# Altium schematic sheet PicoPrint-Connectors.SchDoc
size A3; DocumentNumber: 1; SheetNumber: 1; SheetTotal: 5
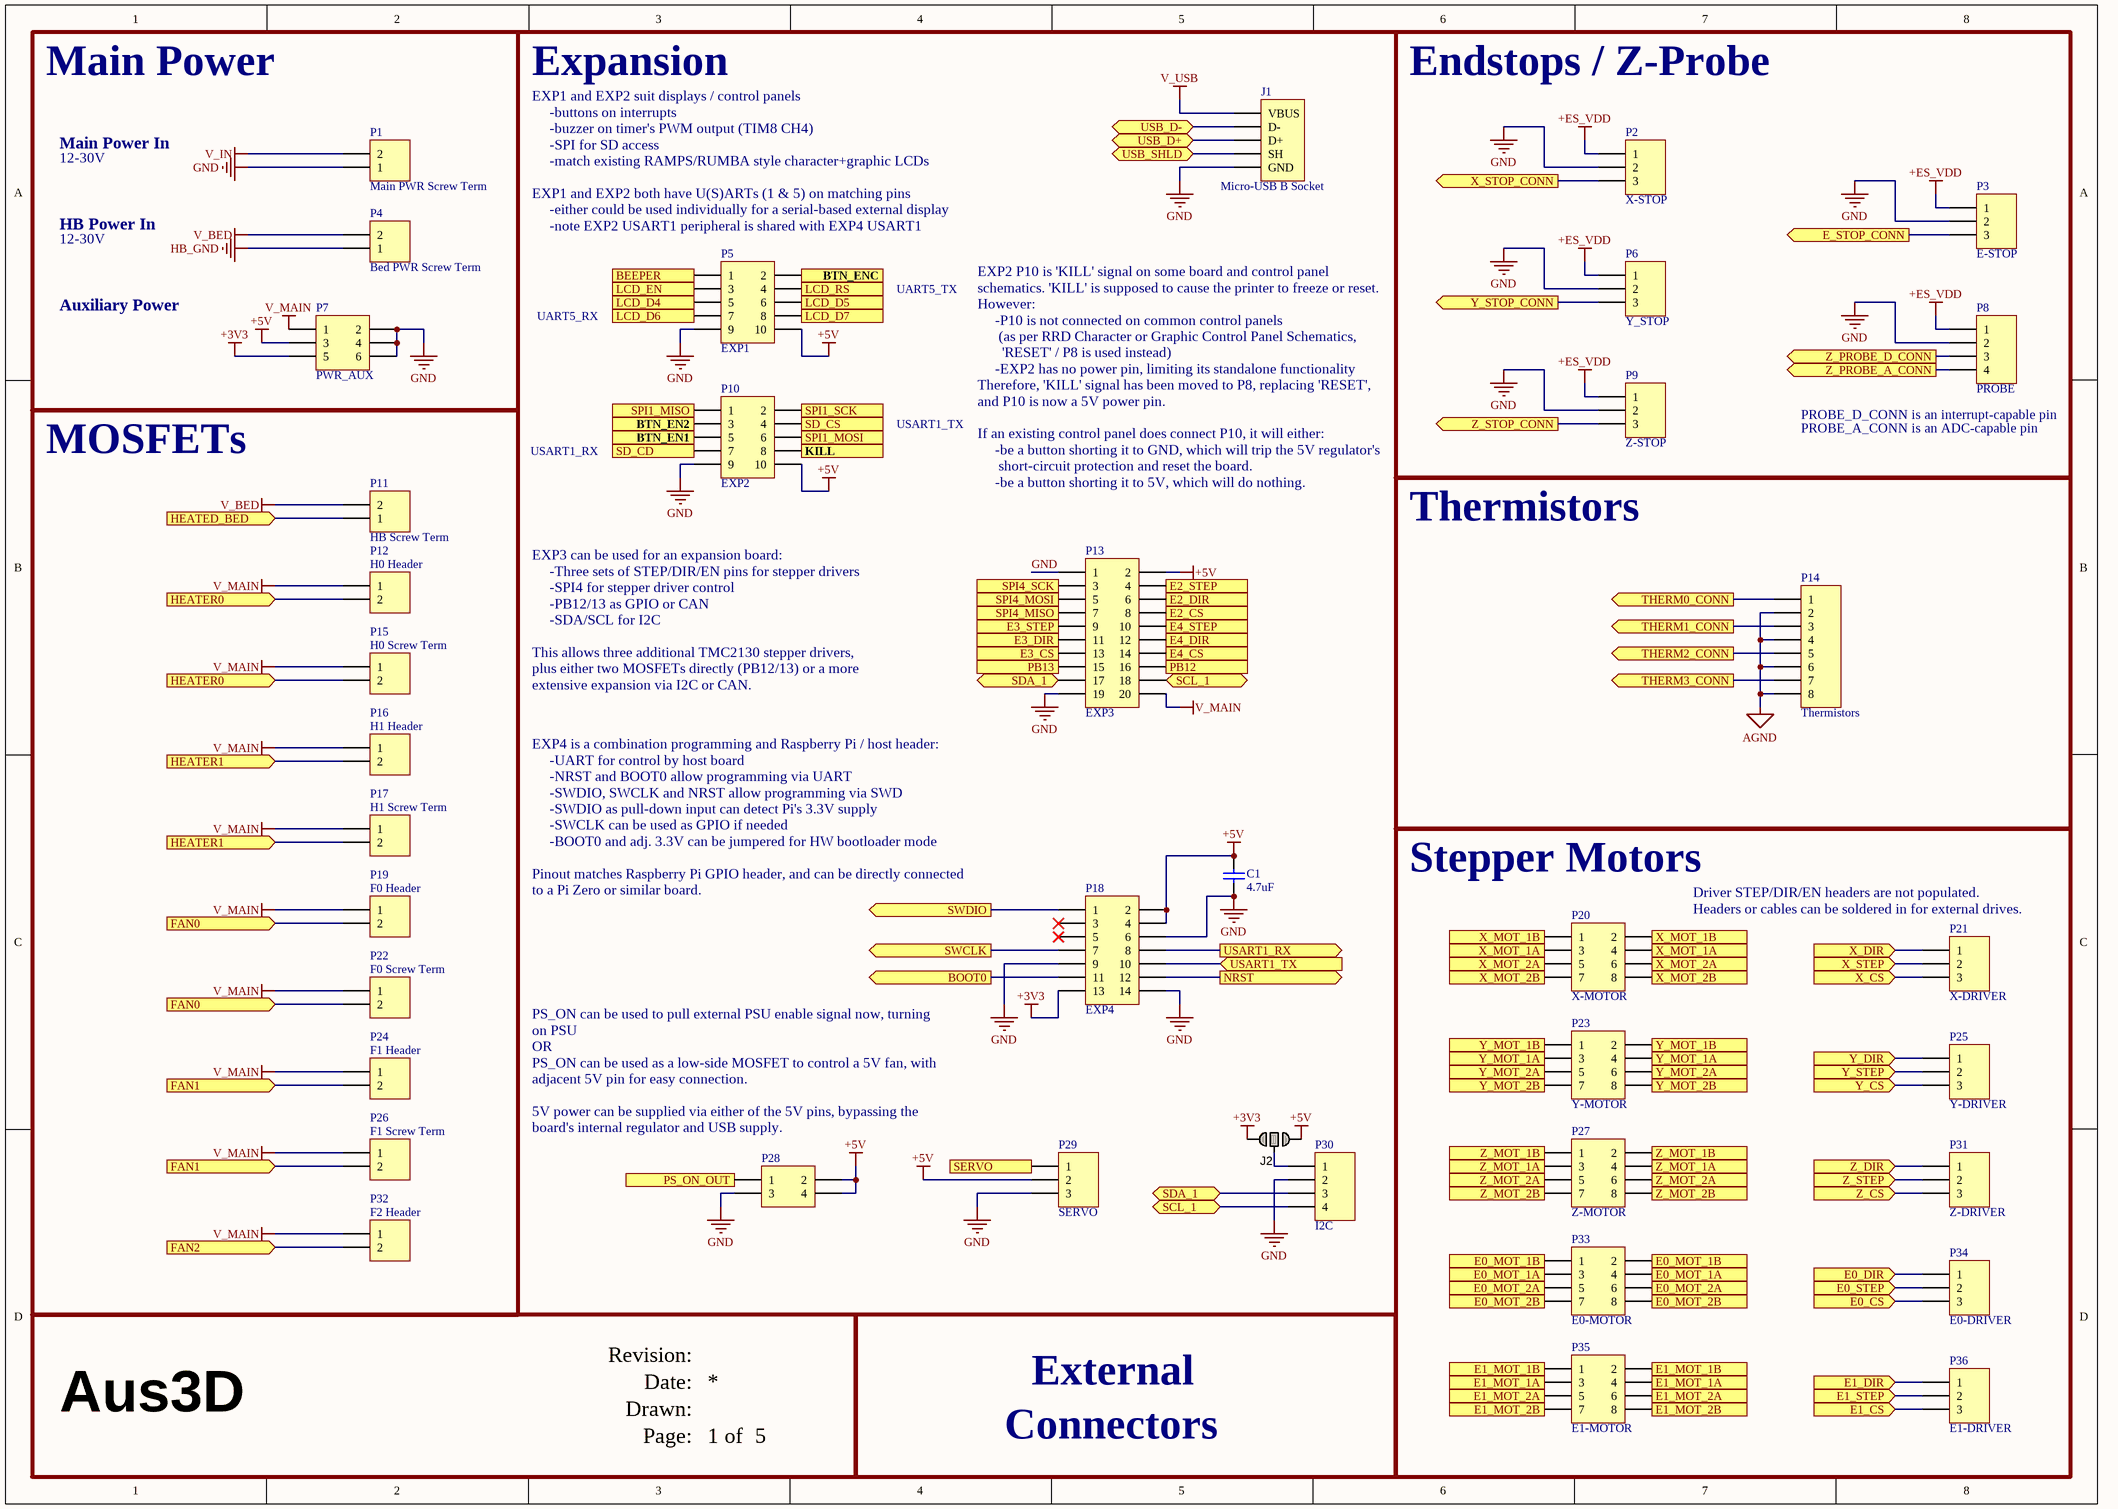
[diagram p0: PicoPrint-Connectors.SchDoc]

## Parts
C1  value 4.7uF  [CAP 1005-0402]  (hidden comment: CapC-0402-4.7uF-10V)
J1  Micro-USB B Socket  [Micro-USB B Molex 105017-0001]
J2  Jumper  [JUMPER-3-NO]  (value not drawn)  (no BOM)
P1  Main PWR Screw Term  [TERM2 5MM]
P2  X-STOP  [HDR1X3-HEADER]
P3  E-STOP  [HDR1X3-HEADER]
P4  Bed PWR Screw Term  [TERM2 5MM]
P5  EXP1  [HDR2X5_exp Iner only\]
P6  Y_STOP  [HDR1X3-HEADER]
P7  PWR_AUX  [HDR2X3-Header]
P8  PROBE  [HDR1X4-HEADER]
P9  Z-STOP  [HDR1X3-HEADER]
P10  EXP2  [HDR2X5_exp Iner only\]
P11  HB Screw Term  [TERM2 5MM]
P12  H0 Header  [HDR1X2-HEADER]
P13  EXP3  [HDR2X10-HEADER]
P14  Thermistors  [HDR1X8-HEADER]
P15  H0 Screw Term  [TERM2 3.5mm]
P16  H1 Header  [HDR1X2-HEADER]
P17  H1 Screw Term  [TERM2 3.5mm]
P18  EXP4  [HDR2X7]
P19  F0 Header  [HDR1X2-HEADER]
P20  X-MOTOR  [HDR2X4-HEADER]
P21  X-DRIVER  [MHDR1X3]  (no BOM)
P22  F0 Screw Term  [TERM2 3.5mm]
P23  Y-MOTOR  [HDR2X4-HEADER]
P24  F1 Header  [HDR1X2-HEADER]
P25  Y-DRIVER  [MHDR1X3]  (no BOM)
P26  F1 Screw Term  [TERM2 3.5mm]
P27  Z-MOTOR  [HDR2X4-HEADER]
P28  Header 2X2  [HDR2X2-Header]  (value not drawn)
P29  SERVO  [HDR1X3-HEADER]
P30  I2C  [HDR1X4-HEADER]
P31  Z-DRIVER  [MHDR1X3]  (no BOM)
P32  F2 Header  [HDR1X2-HEADER]
P33  E0-MOTOR  [HDR2X4-HEADER]
P34  E0-DRIVER  [MHDR1X3]  (no BOM)
P35  E1-MOTOR  [HDR2X4-HEADER]
P36  E1-DRIVER  [MHDR1X3]  (no BOM)

## Blocks framed on the sheet
Main Power: P1 P4 P7
Endstops / Z-Probe: P2 P3 P6 P8 P9
MOSFETs: P11 P12 P15-P17 P19 P22 P24 P26 P32
Thermistors: P14
Stepper Motors: P20 P21 P23 P25 P27 P31 P33-P36

## Ports
BEEPER (in), BOOT0 (out), BTN_EN1 (out), BTN_EN2 (out), BTN_ENC (out), E0_CS (in), E0_DIR (in), E0_MOT_1A (in), E0_MOT_1B (in), E0_MOT_2A (in), E0_MOT_2B (in), E0_STEP (in), E1_CS (in), E1_DIR (in), E1_MOT_1A (in), E1_MOT_1B (in), E1_MOT_2A (in), E1_MOT_2B (in), E1_STEP (in), E2_CS (in), E2_DIR (in), E2_STEP (in), E3_CS (in), E3_DIR (in), E3_STEP (in), E4_CS (in), E4_DIR (in), E4_STEP (in), E_STOP_CONN (out), FAN0 (in), FAN1 (in), FAN2 (in), HEATED_BED (in), HEATER0 (in), HEATER1 (in), KILL (out), LCD_D4 (in), LCD_D5 (in), LCD_D6 (in), LCD_D7 (in), LCD_EN (in), LCD_RS (in), NRST (out), PB12 (in), PB13 (in), PS_ON_OUT (out), SCL_1 (bidir), SD_CD (out), SD_CS (in), SDA_1 (bidir), SERVO (in), SPI1_MISO (in), SPI1_MOSI (out), SPI1_SCK (out), SPI4_MISO (in), SPI4_MOSI (out), SPI4_SCK (out), SWCLK (out), SWDIO (out), THERM0_CONN (out), THERM1_CONN (out), THERM2_CONN (out), THERM3_CONN (out), USART1_RX (out), USART1_TX (in), USB_D+ (bidir), USB_D- (bidir), USB_SHLD (bidir), X_CS (in), X_DIR (in), X_MOT_1A (in), X_MOT_1B (in), X_MOT_2A (in), X_MOT_2B (in), X_STEP (in), X_STOP_CONN (out), Y_CS (in), Y_DIR (in), Y_MOT_1A (in), Y_MOT_1B (in), Y_MOT_2A (in), Y_MOT_2B (in), Y_STEP (in), Y_STOP_CONN (out), Z_CS (in), Z_DIR (in), Z_MOT_1A (in), Z_MOT_1B (in), Z_MOT_2A (in), Z_MOT_2B (in), Z_PROBE_A_CONN (out), Z_PROBE_D_CONN (out), Z_STEP (in), Z_STOP_CONN (out)

## Nets
+3V3: J2.1 P7.5 P18.13
+5V: C1.2 J2.3 P5.10 P7.3 P10.10 P13.2 P18.2 P18.4 P28.2 P28.4 P29.2
+ES_VDD: P2.1 P3.1 P6.1 P8.1 P9.1
AGND: P14.2 P14.4 P14.6 P14.8
GND: C1.1 J1.GND P1.1 P2.2 P3.2 P5.9 P6.2 P7.2 P7.4 P7.6 P8.2 P9.2 P10.9 P13.1 P13.19 P18.6 P18.9 P18.14 P28.3 P29.3 P30.2
HB_GND: P4.1
V_BED: P4.2 P11.2
V_IN: P1.2
V_MAIN: P7.1 P12.1 P13.20 P15.1 P16.1 P17.1 P19.1 P22.1 P24.1 P26.1 P32.1
V_USB: J1.VBUS
BEEPER: P5.1 ; port BEEPER
BOOT0: P18.11 ; port BOOT0
BTN_EN1: P10.5 ; port BTN_EN1
BTN_EN2: P10.3 ; port BTN_EN2
BTN_ENC: P5.2 ; port BTN_ENC
E0_CS: P34.3 ; port E0_CS
E0_DIR: P34.1 ; port E0_DIR
E0_MOT_1A: P33.3 P33.4 ; port E0_MOT_1A
E0_MOT_1B: P33.1 P33.2 ; port E0_MOT_1B
E0_MOT_2A: P33.5 P33.6 ; port E0_MOT_2A
E0_MOT_2B: P33.7 P33.8 ; port E0_MOT_2B
E0_STEP: P34.2 ; port E0_STEP
E1_CS: P36.3 ; port E1_CS
E1_DIR: P36.1 ; port E1_DIR
E1_MOT_1A: P35.3 P35.4 ; port E1_MOT_1A
E1_MOT_1B: P35.1 P35.2 ; port E1_MOT_1B
E1_MOT_2A: P35.5 P35.6 ; port E1_MOT_2A
E1_MOT_2B: P35.7 P35.8 ; port E1_MOT_2B
E1_STEP: P36.2 ; port E1_STEP
E2_CS: P13.8 ; port E2_CS
E2_DIR: P13.6 ; port E2_DIR
E2_STEP: P13.4 ; port E2_STEP
E3_CS: P13.13 ; port E3_CS
E3_DIR: P13.11 ; port E3_DIR
E3_STEP: P13.9 ; port E3_STEP
E4_CS: P13.14 ; port E4_CS
E4_DIR: P13.12 ; port E4_DIR
E4_STEP: P13.10 ; port E4_STEP
E_STOP_CONN: P3.3 ; port E_STOP_CONN
FAN0: P19.2 P22.2 ; port FAN0
FAN1: P24.2 P26.2 ; port FAN1
FAN2: P32.2 ; port FAN2
HEATED_BED: P11.1 ; port HEATED_BED
HEATER0: P12.2 P15.2 ; port HEATER0
HEATER1: P16.2 P17.2 ; port HEATER1
KILL: P10.8 ; port KILL
LCD_D4: P5.5 ; port LCD_D4
LCD_D5: P5.6 ; port LCD_D5
LCD_D6: P5.7 ; port LCD_D6
LCD_D7: P5.8 ; port LCD_D7
LCD_EN: P5.3 ; port LCD_EN
LCD_RS: P5.4 ; port LCD_RS
NRST: P18.12 ; port NRST
PB12: P13.16 ; port PB12
PB13: P13.15 ; port PB13
PS_ON_OUT: P28.1 ; port PS_ON_OUT
SCL_1: P13.18 P30.4 ; port SCL_1
SD_CD: P10.7 ; port SD_CD
SD_CS: P10.4 ; port SD_CS
SDA_1: P13.17 P30.3 ; port SDA_1
SERVO: P29.1 ; port SERVO
SPI1_MISO: P10.1 ; port SPI1_MISO
SPI1_MOSI: P10.6 ; port SPI1_MOSI
SPI1_SCK: P10.2 ; port SPI1_SCK
SPI4_MISO: P13.7 ; port SPI4_MISO
SPI4_MOSI: P13.5 ; port SPI4_MOSI
SPI4_SCK: P13.3 ; port SPI4_SCK
SWCLK: P18.7 ; port SWCLK
SWDIO: P18.1 ; port SWDIO
THERM0_CONN: P14.1 ; port THERM0_CONN
THERM1_CONN: P14.3 ; port THERM1_CONN
THERM2_CONN: P14.5 ; port THERM2_CONN
THERM3_CONN: P14.7 ; port THERM3_CONN
USART1_RX: P18.8 ; port USART1_RX
USART1_TX: P18.10 ; port USART1_TX
USB_D+: J1.D+ ; port USB_D+
USB_D-: J1.D- ; port USB_D-
USB_SHLD: J1.SHIELD(SH) ; port USB_SHLD
X_CS: P21.3 ; port X_CS
X_DIR: P21.1 ; port X_DIR
X_MOT_1A: P20.3 P20.4 ; port X_MOT_1A
X_MOT_1B: P20.1 P20.2 ; port X_MOT_1B
X_MOT_2A: P20.5 P20.6 ; port X_MOT_2A
X_MOT_2B: P20.7 P20.8 ; port X_MOT_2B
X_STEP: P21.2 ; port X_STEP
X_STOP_CONN: P2.3 ; port X_STOP_CONN
Y_CS: P25.3 ; port Y_CS
Y_DIR: P25.1 ; port Y_DIR
Y_MOT_1A: P23.3 P23.4 ; port Y_MOT_1A
Y_MOT_1B: P23.1 P23.2 ; port Y_MOT_1B
Y_MOT_2A: P23.5 P23.6 ; port Y_MOT_2A
Y_MOT_2B: P23.7 P23.8 ; port Y_MOT_2B
Y_STEP: P25.2 ; port Y_STEP
Y_STOP_CONN: P6.3 ; port Y_STOP_CONN
Z_CS: P31.3 ; port Z_CS
Z_DIR: P31.1 ; port Z_DIR
Z_MOT_1A: P27.3 P27.4 ; port Z_MOT_1A
Z_MOT_1B: P27.1 P27.2 ; port Z_MOT_1B
Z_MOT_2A: P27.5 P27.6 ; port Z_MOT_2A
Z_MOT_2B: P27.7 P27.8 ; port Z_MOT_2B
Z_PROBE_A_CONN: P8.4 ; port Z_PROBE_A_CONN
Z_PROBE_D_CONN: P8.3 ; port Z_PROBE_D_CONN
Z_STEP: P31.2 ; port Z_STEP
Z_STOP_CONN: P9.3 ; port Z_STOP_CONN
NetJ2_2: J2.2 P30.1

Not connected (* = marked no-connect by the designer): P18 3* 5*

## Notes on the sheet
- Expansion
- Main Power In
- 12-30V
- HB Power In
- (near P5) EXP1 and EXP2 suit displays / control panels
  -buttons on interrupts
  -buzzer on timer's PWM output (TIM8 CH4)
  -SPI for SD access
  -match existing RAMPS/RUMBA style character+graphic LCDs
  EXP1 and EXP2 both have U(S)ARTs (1 & 5) on matching pins
  -either could be used individually for a serial-based external display
  -note EXP2 USART1 peripheral is shared with EXP4 USART1
- Auxiliary Power
- UART5_RX
- UART5_TX
- USART1_RX
- USART1_TX
- (near P8) PROBE_D_CONN is an interrupt-capable pin
- (near P8) PROBE_A_CONN is an ADC-capable pin
- EXP2 P10 is 'KILL' signal on some board and control panel schematics. 'KILL' is supposed to cause the printer to freeze or reset. However:
  -P10 is not connected on common control panels
  (as per RRD Character or Graphic Control Panel Schematics,
  'RESET' / P8 is used instead)
  -EXP2 has no power pin, limiting its standalone functionality
  Therefore, 'KILL' signal has been moved to P8, replacing 'RESET', and P10 is now a 5V power pin.
  If an existing control panel does connect P10, it will either:
  -be a button shorting it to GND, which will trip the 5V regulator's
  short-circuit protection and reset the board.
  -be a button shorting it to 5V, which will do nothing.
- EXP3 can be used for an expansion board:
  -Three sets of STEP/DIR/EN pins for stepper drivers
  -SPI4 for stepper driver control
  -PB12/13 as GPIO or CAN
  -SDA/SCL for I2C
  This allows three additional TMC2130 stepper drivers,
  plus either two MOSFETs directly (PB12/13) or a more extensive expansion via I2C or CAN.
- EXP4 is a combination programming and Raspberry Pi / host header:
  -UART for control by host board
  -NRST and BOOT0 allow programming via UART
  -SWDIO, SWCLK and NRST allow programming via SWD
  -SWDIO as pull-down input can detect Pi's 3.3V supply
  -SWCLK can be used as GPIO if needed
  -BOOT0 and adj. 3.3V can be jumpered for HW bootloader mode
  Pinout matches Raspberry Pi GPIO header, and can be directly connected to a Pi Zero or similar board.
- (near P21) Driver STEP/DIR/EN headers are not populated.
  Headers or cables can be soldered in for external drives.
- (near P28) PS_ON can be used to pull external PSU enable signal now, turning on PSU
  OR
  PS_ON can be used as a low-side MOSFET to control a 5V fan, with adjacent 5V pin for easy connection.
  5V power can be supplied via either of the 5V pins, bypassing the board's internal regulator and USB supply.
- Date:
- Revision:
- External
- Aus3D
- Drawn:
- Page:
- of
- Connectors

## Library data of the parts
C1 = CapC-0402-4.7uF-10V: Capacitor (SMD Ceramic); Voltage: 10V; Note: Approved sub OK; Published: 8-Jun-2000; Revision: July-2002: Re-released for DXP Platform.; Publisher: Altium Limited; Supplier 1: Digi-Key; Supplier Part Number 1: 1276-1482-1-ND
J1 = Micro-USB B Socket: Note: Approved sub OK; Supplier 1: Digi-Key; Supplier Part Number 1: WM1399CT-ND
J2 = JUMP3-NO: SMD jumper
P1 P4 P11 = ScrewTerminal-5mm-2Way: Screw Terminal 5mm 2-Way; Supplier 1: Digi-Key; Supplier Part Number 1: 277-6405-ND
P2 P3 P6 P9 P29 = Header 3: Header, 3-Pin; Manufacturer 1: Generic Header; Note: Approved sub OK; LatestRevisionDate: 17-Jul-2002; LatestRevisionNote: Re-released for DXP Platform.; Publisher: Altium Limited
P5 P10 = Header 5X2: Header, 5-Pin, Dual row; Manufacturer 1: Generic Header; Note: Approved sub OK; LatestRevisionDate: 17-Jul-2002; LatestRevisionNote: Re-released for DXP Platform.; Publisher: Altium Limited
P7 = Header 3X2: Header, 3-Pin, Dual row; Manufacturer 1: Generic Header; Note: Approved sub OK; LatestRevisionDate: 17-Jul-2002; LatestRevisionNote: Re-released for DXP Platform.; Publisher: Altium Limited
P8 P30 = Header 4: Header, 4-Pin; Manufacturer 1: Generic Header; Note: Approved sub OK; LatestRevisionDate: 17-Jul-2002; LatestRevisionNote: Re-released for DXP Platform.; Publisher: Altium Limited
P12 P16 P19 P24 P32 = Header 2: Header, 2-Pin; Manufacturer 1: Generic Header; Note: Approved sub OK; LatestRevisionDate: 17-Jul-2002; LatestRevisionNote: Re-released for DXP Platform.; Publisher: Altium Limited
P13 = Header 10X2: Header, 10-Pin, Dual row; Manufacturer 1: Generic Header; Note: Approved sub OK; LatestRevisionDate: 17-Jul-2002; LatestRevisionNote: Re-released for DXP Platform.; Publisher: Altium Limited
P14 = Header 8x1: Header, 8-Pin; Manufacturer 1: Generic Header; Note: Approved sub OK; LatestRevisionDate: 17-Jul-2002; LatestRevisionNote: Re-released for DXP Platform.; Publisher: Altium Limited
P15 P17 P22 P26 = ScrewTerminal-3.5mm-2Way: Screw Terminal 3.5mm 2-Way; Supplier 1: Digi-Key; Supplier Part Number 1: 277-1721-ND
P18 = Header 7X2: Header, 7-Pin, Dual row; Manufacturer 1: Generic Header; Note: Approved sub OK; LatestRevisionDate: 17-Jul-2002; LatestRevisionNote: Re-released for DXP Platform.; Publisher: Altium Limited
P20 P23 P27 P33 P35 = Header 4X2: Header, 4-Pin, Dual row; Manufacturer 1: Generic Header; Note: Approved sub OK; LatestRevisionDate: 17-Jul-2002; LatestRevisionNote: Re-released for DXP Platform.; Publisher: Altium Limited
P21 P25 P31 P34 P36 = MHDR1X3: Header, 3-Pin; LatestRevisionDate: 17-Jul-2002; LatestRevisionNote: Re-released for DXP Platform.; Publisher: Altium Limited
P28 = Header 2X2: Header, 3-Pin, Dual row; Manufacturer 1: Generic Header; Note: Approved sub OK; LatestRevisionDate: 17-Jul-2002; LatestRevisionNote: Re-released for DXP Platform.; Publisher: Altium Limited